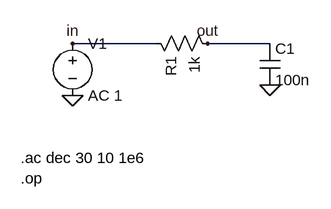
[diagram p0: schematic rc_lowpass_ac.asc]
rc_lowpass_ac.asc, the LTspice schematic file:
Version 4
SHEET 1 1200 900
WIRE 128 176 256 176
WIRE 336 176 432 176
FLAG 128 176 in
FLAG 336 176 out
FLAG 128 256 0
FLAG 432 240 0
SYMBOL voltage 128 160 R0
SYMATTR InstName V1
SYMATTR Value AC 1
SYMBOL res 240 160 M90
SYMATTR InstName R1
SYMATTR Value 1k
SYMBOL cap 416 176 R0
SYMATTR InstName C1
SYMATTR Value 100n
TEXT 48 352 Left 2 !.ac dec 30 10 1e6
TEXT 48 384 Left 2 !.op

The netlist it stands for:
* rc_lowpass_ac.asc
V1 in 0 AC 1
R1 in out 1k
C1 out 0 100n
.ac dec 30 10 1e6
.op
.backanno
.end